# EasyEDA Pro project functional hub.epro, schematic Schematic1
Board Name: Board1; Create Date: 2026-05-01; Page Name: P1; Project Name: hub; Schematic Name: Schematic1; Update Date: 2026-05-04; Company: EasyEDA.com; Page Size: A4; Version: V1.0
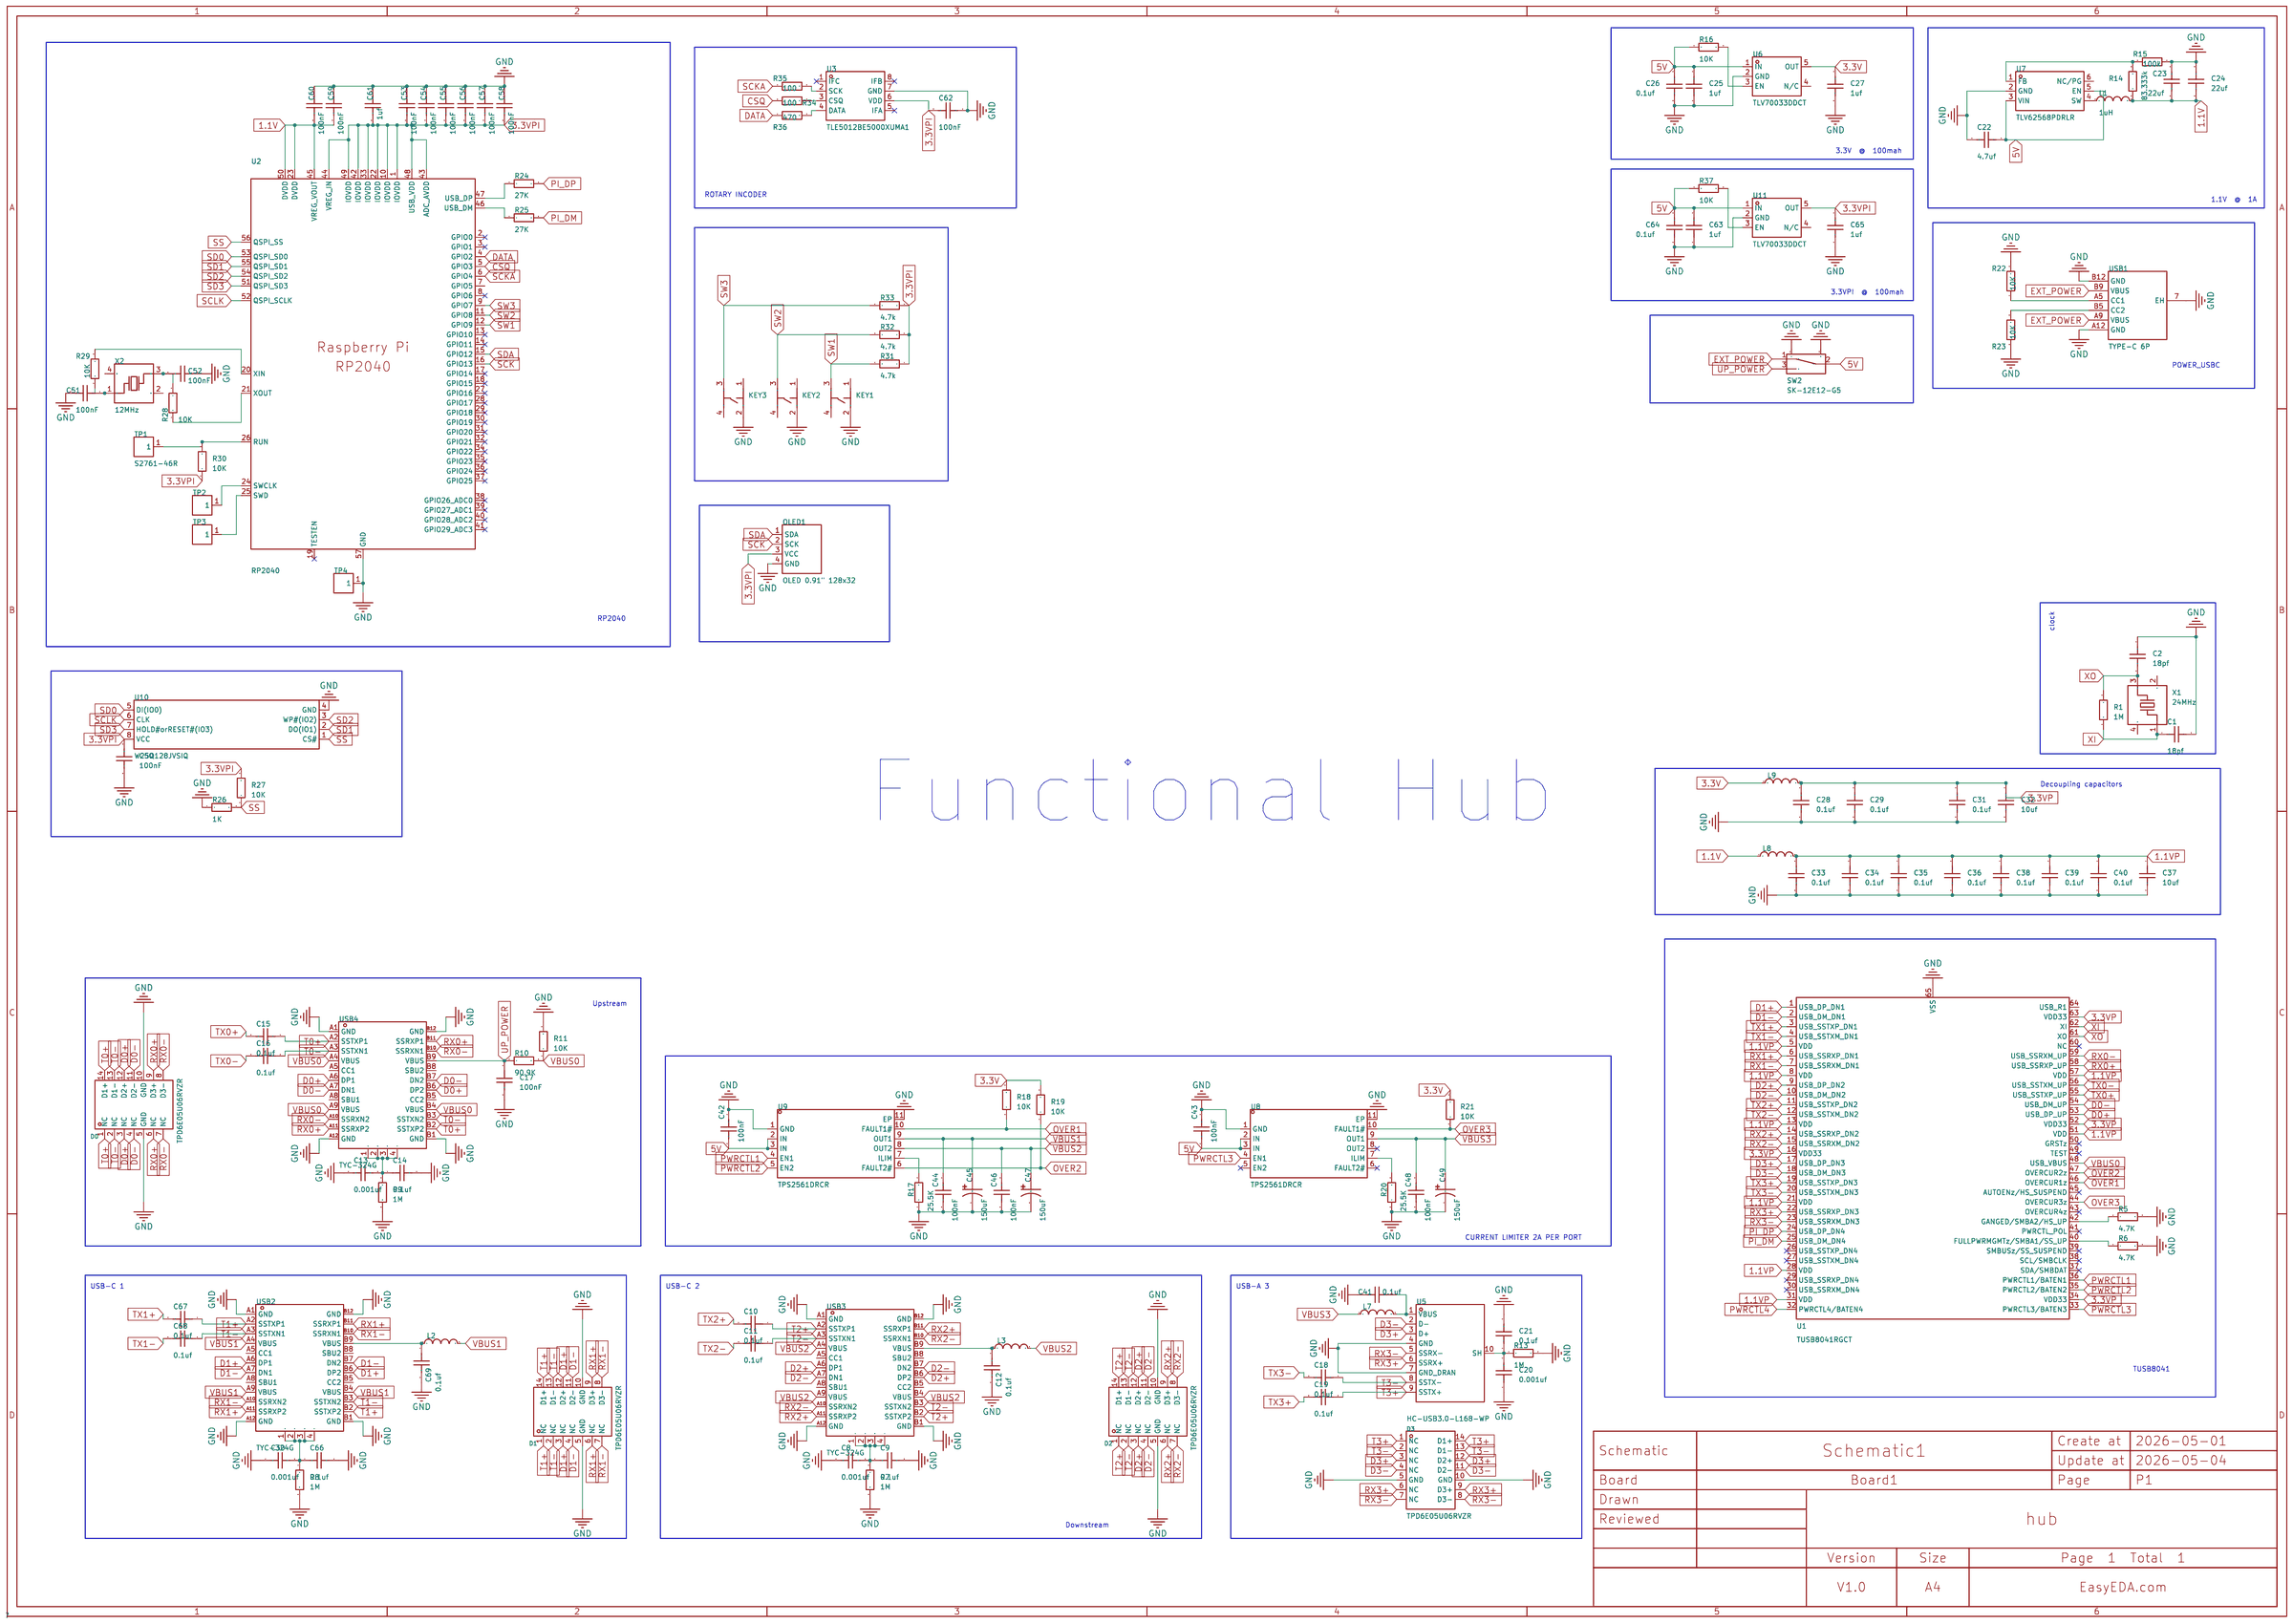
[diagram p0: schematic sheet]

## Parts
C1  18pf  [C0201]
C2  18pf  [C0201]
C8  0.001uf  [C0201]
C9  0.1uf  [C0201]
C10  0.1uf  [C0201]
C11  0.1uf  [C0201]
C12  0.1uf  [C0201]
C13  0.001uf  [C0201]
C14  0.1uf  [C0201]
C15  0.1uf  [C0201]
C16  0.1uf  [C0201]
C17  100nF  [C0201]
C18  0.1uf  [C0201]
C19  0.1uf  [C0201]
C20  0.001uf  [C0201]
C21  0.1uf  [C0201]
C22  4.7uf  [C0201]
C23  22uf  [C0201]
C24  22uf  [C0201]
C25  1uf  [C0201]
C26  0.1uf  [C0201]
C27  1uf  [C0201]
C28  0.1uf  [C0201]
C29  0.1uf  [C0201]
C30  0.001uf  [C0201]
C31  0.1uf  [C0201]
C32  10uf  [C0201]
C33  0.1uf  [C0201]
C34  0.1uf  [C0201]
C35  0.1uf  [C0201]
C36  0.1uf  [C0201]
C37  10uf  [C0201]
C38  0.1uf  [C0201]
C39  0.1uf  [C0201]
C40  0.1uf  [C0201]
C41  0.1uf  [C0201]
C42  100nF  [C0201]
C43  100nF  [C0201]
C44  100nF  [C0201]
C45  150uF  [CAP-SMD_BD5.0-L5.3-W5.3-FD]
C46  100nF  [C0201]
C47  150uF  [CAP-SMD_BD5.0-L5.3-W5.3-FD]
C48  100nF  [C0201]
C49  150uF  [CAP-SMD_BD5.0-L5.3-W5.3-FD]
C50  100nF  [C0201]
C51  100nF  [C0201]
C52  100nF  [C0201]
C53  100nF  [C0201]
C54  100nF  [C0201]
C55  100nF  [C0201]
C56  100nF  [C0201]
C57  100nF  [C0201]
C58  100nF  [C0201]
C59  100nF  [C0201]
C60  100nF  [C0201]
C61  1uf  [C0201]
C62  100nF  [C0201]
C63  1uf  [C0201]
C64  0.1uf  [C0201]
C65  1uf  [C0201]
C66  0.1uf  [C0201]
C67  0.1uf  [C0201]
C68  0.1uf  [C0201]
C69  0.1uf  [C0201]
D0  TPD6E05U06RVZR  [USON-14_L3.5-W1.4-P0.5-BL]
D1  TPD6E05U06RVZR  [USON-14_L3.5-W1.4-P0.5-BL]
D2  TPD6E05U06RVZR  [USON-14_L3.5-W1.4-P0.5-BL]
D3  TPD6E05U06RVZR  [USON-14_L3.5-W1.4-P0.5-BL]
KEY1  B3F-4055  [KEY-TH_4P-L12.0-W12.0-P5.00-LS13.4-EH]
KEY2  B3F-4055  [KEY-TH_4P-L12.0-W12.0-P5.00-LS13.4-EH]
KEY3  B3F-4055  [KEY-TH_4P-L12.0-W12.0-P5.00-LS13.4-EH]
L1  1uH  [L0402]
L2  BLM18KG221SN1D  [L0402]
L3  BLM18KG221SN1D  [L0402]
L7  BLM18KG221SN1D  [L0402]
L8  BLM18KG221SN1D  [L0402]
L9  BLM18KG221SN1D  [L0402]
OLED1  OLED 0.91" 128x32  [OLED_0.91_128X32]
R1  1M  [R0201]
R5  4.7K  [R0201]
R6  4.7K  [R0201]
R7  1M  [R0201]
R8  1M  [R0201]
R9  1M  [R0201]
R10  90.9K  [R0201]
R11  10K  [R0201]
R13  1M  [R0201]
R14  83.333k  [R0201]
R15  100k  [R0201]
R16  10K  [R0201]
R17  25.5K  [R0201]
R18  10K  [R0201]
R19  10K  [R0201]
R20  25.5K  [R0201]
R21  10K  [R0201]
R22  10K  [R0201]
R23  10K  [R0201]
R24  27K  [R0201]
R25  27K  [R0201]
R26  1K  [R0201]
R27  10K  [R0201]
R28  10K  [R0201]
R29  10K  [R0201]
R30  10K  [R0201]
R31  4.7k  [R0201]
R32  4.7k  [R0201]
R33  4.7k  [R0201]
R34  100  [R0201]
R35  100  [R0201]
R36  470  [R0201]
R37  10K  [R0201]
SW2  SK-12E12-G5  [SW-TH_SK-12E12-G5]
TP1  S2761-46R  [TESTPOINT-SMD_L1.6-W0.8_RCU-0C]
TP2  S2761-46R  [TESTPOINT-SMD_L1.6-W0.8_RCU-0C]
TP3  S2761-46R  [TESTPOINT-SMD_L1.6-W0.8_RCU-0C]
TP4  S2761-46R  [TESTPOINT-SMD_L1.6-W0.8_RCU-0C]
U1  TUSB8041RGCT  [VQFN-64_L9.0-W9.0-P0.50-TL-EP6.3]
U2  RP2040  [LQFN-56_L7.0-W7.0-P0.4-EP]
U3  TLE5012BE5000XUMA1  [PG-DSO-8_L5.0-W4.0-P1.27-LS6.0-BL]
U5  HC-USB3.0-L168-WP  [USB-TH_USB3.0-A]
U6  TLV70033DDCT  [SOT-23-5_L2.9-W1.6-P0.95-LS2.8-BR]
U7  TLV62568PDRLR  [SOT-563_L1.6-W1.2-P0.50-LS1.6-BL]
U8  TPS2561DRCR  [VSON-10_L3.0-W3.0-P0.50-TL-EP_TPS62410DRCR]
U9  TPS2561DRCR  [VSON-10_L3.0-W3.0-P0.50-TL-EP_TPS62410DRCR]
U10  W25Q128JVSIQ  [SOIC-8_L5.3-W5.3-P1.27-LS8.0-BL]
U11  TLV70033DDCT  [SOT-23-5_L2.9-W1.6-P0.95-LS2.8-BR]
USB1  TYPE-C 6P  [TYPE-C-SMD_TYPE-C-6P_1]
USB2  TYC-324G  [USB-C-SMD_TYC-324G]
USB3  TYC-324G  [USB-C-SMD_TYC-324G]
USB4  TYC-324G  [USB-C-SMD_TYC-324G]
X1  24MHz  [CRYSTAL-SMD_4P-L3.2-W2.5-BL]
X2  12MHz  [CRYSTAL-SMD_4P-L3.2-W2.5-BL]

## Library data of the parts
C1 C2 C8-C44 C46 C48 C50-C69 = CAP_0603: Supplier Footprint: 0603
C45 C47 C49 = VZT151M1VTR-0607: Capacitance:150uF Tolerance:±20% Tolerance:±20% Voltage Rating:35V Ripple Current:- Equivalent Series Resistance(ESR):- Diameter:6.3mm Height - Seated (Max):7.7mm Lifetime:2000hrs@105℃ Operating Temperature:-45℃~+105℃ Operating Temperature:-45℃~+105℃; LCSC Part Name: 150uF ±20% 35V; Supplier Part: C249984; Manufacturer: Lelon(立隆); Supplier Footprint: SMD,D6.3xL7.7mm; JLCPCB Part Class: Extended Part; Datasheet: https://item.szlcsc.com/datasheet/VZT151M1VTR-0607/246106.html; Supplier: LCSC; Tolerance: ±20%; Voltage Rating: 35V; Diameter: 6.3mm; Height - Seated (Max): 7.7mm; Lifetime: 2000hrs@105℃; Operating Temperature: -45℃~+105℃
D0-D3 = TPD6E05U06RVZR: Reverse Stand-Off Voltage (Vrwm):5.5V@Max Maximum Clamping Voltage:14V Peak Pulse Current (Ipp)@10/1000us:- Peak Pulse Power Dissipation (Ppp)@10/1000us:40W Breakdown Voltage:6V Type:TVS; Supplier Part: C962978; Manufacturer: TI(德州仪器); Supplier Footprint: USON-14(1.4x3.5); JLCPCB Part Class: Extended Part; Datasheet: https://www.ti.com/cn/lit/gpn/tpd1e05u06; Supplier: LCSC; Reverse Stand-Off Voltage (Vrwm): 5.5V@Max; Maximum Clamping Voltage: 14V; Peak Pulse Power Dissipation (Ppp)@10/1000us: 40W; Breakdown Voltage: 6V; Type: TVS
KEY1-KEY3 = B3F-4055_C84931: Circuit:SPST Actuator Style:Rectangular Button Mounting Type:Through Hole Length:12mm Width:12mm Switch Height:7.3mm Contact Current:50mA Voltage Rating:24V With Lamp:- Life:-; LCSC Part Name: 12*12*7.3mm 直插 轻触开关; Supplier Part: C84931; Manufacturer: OMRON(欧姆龙); Supplier Footprint: 插件-4P,12x12mm; JLCPCB Part Class: Extended Part; Datasheet: https://item.szlcsc.com/datasheet/B3F-4055/86103.html; Supplier: LCSC; Circuit: SPST; Actuator Style: Rectangular Button; Mounting Type: Through Hole; Length: 12mm; Width: 12mm; Switch Height: 7.3mm; Contact Current: 50mA; Voltage Rating: 24V
L1 = L_0603: Supplier Footprint: L0603
L2 L3 L7-L9 = BLM18KG221SN1D: Impedance @ Frequency:220Ω@100MHz Tolerance:±25% Tolerance:±25% DC Resistance(DCR):50mΩ Current Rating:2.2A Number of Circuits:1 Operating Temperature:-55℃~+125℃ Operating Temperature:-55℃~+125℃; LCSC Part Name: 单路 0603磁珠 阻抗220Ω@100MHz; Supplier Part: C88980; Manufacturer: muRata(村田); Supplier Footprint: 0603; JLCPCB Part Class: Extended Part; Datasheet: https://item.szlcsc.com/datasheet/BLM18KG221SN1D/90160.html; Supplier: LCSC; Impedance @ Frequency: 220Ω@100MHz; Tolerance: ±25%; DC Resistance(DCR): 50mΩ; Current Rating: 2.2A; Number of Circuits: 1; Operating Temperature: -55℃~+125℃
OLED1 = OLED 0.91" 128x32: Supplier: LCSC; Supplier Part: C91220
R1 R5-R11 R13-R37 = Res_0603: Supplier Footprint: 0603
SW2 = SK-12E12-G5: Circuit:SPDT Actuator Style:Rectangular Columnar Termination Style:PC Pin Switch Height:10.6mm Mounting Type:- Current Rating:- Voltage Rating:- Life:5,000 Cycles Operating Temperature:-25℃~+70℃ Operating Temperature:-25℃~+70℃; LCSC Part Name: 卧插双档 滑动开关; Supplier Part: C136720; Manufacturer: 韩国韩荣; Supplier Footprint: 插件; JLCPCB Part Class: Extended Part; Datasheet: https://item.szlcsc.com/datasheet/SK-12E12-G5/148036.html; Supplier: LCSC; Circuit: SPDT; Actuator Style: Rectangular Columnar; Termination Style: PC Pin; Switch Height: 10.6mm; Life: 5,000 Cycles; Operating Temperature: -25℃~+70℃
TP1-TP4 = S2761-46R: LCSC Part Name: SMT测试端子; Supplier Part: C5846954; Manufacturer: Harwin; JLCPCB Part Class: Extended Part; Datasheet: https://item.szlcsc.com/datasheet/S2761-46R/6779008.html; Supplier: LCSC
U1 = TUSB8041RGCT: type:Hub USB Protocol:USB 3.0；USB 2.0 Voltage - Supply:0.99V~1.26V；3V~3.6V Voltage - Supply:0.99V~1.26V；3V~3.6V Operating Temperature:0℃~+70℃ Operating Temperature:0℃~+70℃ Memory Interface:I2C；SMBus Current - Supply:778mA Quiescent Supply Current:33mA Num; LCSC Part Name: 四端口USB3.0集线器; Supplier Part: C702388; Manufacturer: TI(德州仪器); Supplier Footprint: VQFN-64-EP(9x9); Datasheet: https://www.ti.com/cn/lit/gpn/tusb8041; Supplier: LCSC; type: Hub; USB Protocol: USB 3.0；USB 2.0; Voltage - Supply: 0.99V~1.26V；3V~3.6V; Operating Temperature: 0℃~+70℃; Memory Interface: I2C；SMBus; Current - Supply: 778mA; Quiescent Supply Current: 33mA; Number of Channels: 4
U2 = RP2040_C2040: CPU Core:- CPU Maximum Speed:133MHz Number of I/O:30 ADC (Bit):12bit; LCSC Part Name: RP2040（RP2B2）; Supplier Part: C2040; Manufacturer: Raspberry Pi(树莓派); Supplier Footprint: LQFN-56(7x7); JLCPCB Part Class: Extended Part; Datasheet: https://item.szlcsc.com/datasheet/RP2040/2392.html; Supplier: LCSC; CPU Maximum Speed: 133MHz; Number of I/O: 30; ADC (Bit): 12bit
U3 = TLE5012BE5000XUMA1: Voltage - Supply:3V~5.5V Voltage - Supply:3V~5.5V Rotation Angle:0°~360° Rotation Angle:0°~360°; Supplier Part: C2655225; Manufacturer: Infineon(英飞凌); Supplier Footprint: SO-8; Datasheet: https://item.szlcsc.com/datasheet/TLE5012BE5000XUMA1/2747134.html; Supplier: LCSC; Voltage - Supply: 3V~5.5V; Rotation Angle: 0°~360°
U5 = HC-USB3.0-L168-WP: Connector Type:Type-A Protocol Standard:USB 3.0 Gender:Female Mounting Type:Right Angle Number of Contacts:9P Number of Ports:1 Current Rating-Power:1.5A Voltage Rating:30V Connect-Disconnect Life:1,500 Cycles Supplementary Features:- Center Height:- Leng; LCSC Part Name: Type-A 母 弯插 USB3.0 A母90度 弯脚蓝色平口 吸塑盒; Supplier Part: C7501850; Manufacturer: HC(虹成电子); Supplier Footprint: 弯插; Datasheet: https://item.szlcsc.com/datasheet/HC-USB3.0-L168-WP/8585391.html; Supplier: LCSC; Connector Type: Type-A; Protocol Standard: USB 3.0; Gender: Female; Mounting Type: Right Angle; Number of Contacts: 9P; Number of Ports: 1; Current Rating-Power: 1.5A; Voltage Rating: 30V; Connect-Disconnect Life: 1,500 Cycles; Length: 16.8mm; Detection color: Blue; Operating Temperature: -25℃~+70℃
U6 U11 = TLV70033DDCT: Output Type:Fixed Voltage - Supply:5.5V Output Voltage:3.3V Output Voltage:3.3V Output Current:200mA Power Supply Rejection Ratio (PSRR):68dB@(1kHz) Voltage Dropout:175mV@(200mA) standby current:31uA Noise:48uVrms Features:Enable；Over Temperature Protecti; LCSC Part Name: 具有使能功能的 200mA、高 PSRR、低 IQ、低压降稳压器; Supplier Part: C2877582; Manufacturer: TI(德州仪器); Supplier Footprint: SOT-23-5; JLCPCB Part Class: Extended Part; Datasheet: https://www.ti.com/cn/lit/gpn/tlv700; Supplier: LCSC; Output Type: Fixed; Voltage - Supply: 5.5V; Output Voltage: 3.3V; Output Current: 200mA; Power Supply Rejection Ratio (PSRR): 68dB@(1kHz); Voltage Dropout: 175mV@(200mA); standby current: 31uA; Noise: 48uVrms; Features: Enable；Over Temperature Protection；Over Current Protection; Operating Temperature: -40℃~+125℃@(Tj); Output Configuration: Positive; Number of Outputs: 1
U7 = TLV62568PDRLR: Function:Buck Voltage - Supply:2.5V~5.5V Voltage - Supply:2.5V~5.5V Output Voltage:600mV~5.5V Output Voltage:600mV~5.5V Output Current:1A Frequency - Switching:1.5MHz Frequency - Switching:1.5MHz Operating Temperature:-40℃~+125℃@(TJ) Operating Temperature; Supplier Part: C398368; Manufacturer: TI(德州仪器); Supplier Footprint: SOT-563; JLCPCB Part Class: Extended Part; Datasheet: https://www.ti.com/cn/lit/gpn/tlv62568; Supplier: LCSC; Function: Buck; Voltage - Supply: 2.5V~5.5V; Output Voltage: 600mV~5.5V; Output Current: 1A; Frequency - Switching: 1.5MHz; Operating Temperature: -40℃~+125℃@(TJ); Synchronous Rectifier: Yes; Number of Outputs: 1; Topology: Buck; Quiescent Current: 35uA; Switch tube (built-in/external): Built-In; Output Type: Adjustable
U8 U9 = TPS2561DRCR: Type:High Side Switch Number of Channels:2 Control Input Logic:Active High Maximum Continuous Current:2.8A Voltage - Supply:2.5V~6.5V Voltage - Supply:2.5V~6.5V RDS(on):44mΩ Operating Temperature-:-40℃~+125℃ Operating Temperature-:-40℃~+125℃ Features:Ov; LCSC Part Name: 双通道精密可调限流电源开关; Supplier Part: C140303; Manufacturer: TI(德州仪器); Supplier Footprint: VSON-10-EP(3x3); JLCPCB Part Class: Extended Part; Datasheet: https://www.ti.com/cn/lit/gpn/tps2561; Supplier: LCSC; Type: High Side Switch; Number of Channels: 2; Control Input Logic: Active High; Maximum Continuous Current: 2.8A; Voltage - Supply: 2.5V~6.5V; RDS(on): 44mΩ; Operating Temperature	-: -40℃~+125℃; Features: Overtemperature protection (OTP)；Overcurrent Protection(OCP)
U10 = W25Q128JVSIQ_C113767: Interface:SPI Memory Size:- Clock Frequency:133MHz Voltage - Supply:2.7V~3.6V Voltage - Supply:2.7V~3.6V Program / Erase Cycles:100,000 Cycles Page Programming Time (Tpp):3ms Operating Temperature:- Operating Temperature:-; LCSC Part Name: 支持双路/四路SPI接口的3V、128Mbit 串行闪存; Supplier Part: C113767; Manufacturer: Winbond(华邦); Supplier Footprint: SOIC-8-208mil; JLCPCB Part Class: Extended Part; Datasheet: https://item.szlcsc.com/datasheet/W25Q128JVSIQ/115003.html; Supplier: LCSC; Interface: SPI; Clock Frequency: 133MHz; Voltage - Supply: 2.7V~3.6V; Program / Erase Cycles: 100,000 Cycles; Page Programming Time (Tpp): 3ms
USB1 = TYPE-C 6P: Connector Type:Type-C Protocol Standard:- Gender:Female Mounting Type:Surface Mount, Right Angle Number of Contacts:6P Number of Ports:1 Current Rating-Power:3A Voltage Rating:5V Connect-Disconnect Life:3,000 Cycles Supplementary Features:- Center Height:; LCSC Part Name: 6P卧贴母座; Supplier Part: C456012; Manufacturer: SHOU HAN(首韩); Supplier Footprint: SMD; JLCPCB Part Class: Extended Part; Datasheet: https://item.szlcsc.com/datasheet/TYPE-C%25206P/458819.html; Supplier: LCSC; Connector Type: Type-C; Gender: Female; Mounting Type: Surface Mount, Right Angle; Number of Contacts: 6P; Number of Ports: 1; Current Rating-Power: 3A; Voltage Rating: 5V; Connect-Disconnect Life: 3,000 Cycles; Detection color: Black; Operating Temperature: -40℃~+85℃
USB2-USB4 = TYC-324G: Connector Type:Type-C Protocol Standard:USB 3.1 Gender:Female Mounting Type:Surface Mount, Right Angle Number of Contacts:24P Number of Ports:1 Current Rating-Power:5A Voltage Rating:- Connect-Disconnect Life:10,000 Cycles Length:7.9mm Detection color:Bla; LCSC Part Name: Type-C 母 卧贴; Supplier Part: C381478; Manufacturer: XUNPU(讯普); Supplier Footprint: SMD; JLCPCB Part Class: Extended Part; Datasheet: https://item.szlcsc.com/datasheet/TYC-324G/354099.html; Supplier: LCSC; Connector Type: Type-C; Protocol Standard: USB 3.1; Gender: Female; Mounting Type: Surface Mount, Right Angle; Number of Contacts: 24P; Number of Ports: 1; Current Rating-Power: 5A; Connect-Disconnect Life: 10,000 Cycles; Length: 7.9mm; Detection color: Black; Operating Temperature: -30℃~+80℃
X1 = ABM8-24.000MHZ-B2-T: Type:Crystal Oscillator Frequency:24MHz Normal temperature Frequency Tolerance:±20ppm Normal temperature Frequency Tolerance:±20ppm Load Capacitance:18pF Frequency Stability:±50ppm Frequency Stability:±50ppm Equivalent Series Resistance(ESR):50Ω Operating; LCSC Part Name: 24MHz ±20ppm 18pF; Supplier Part: C596897; Manufacturer: ABRACON; Supplier Footprint: SMD3225-4P; Datasheet: https://item.szlcsc.com/datasheet/ABM8-24.000MHZ-B2-T/625513.html; Supplier: LCSC; Type: Crystal Oscillator; Normal temperature Frequency Tolerance: ±20ppm; Load Capacitance: 18pF; Frequency Stability: ±50ppm; Equivalent Series Resistance(ESR): 50Ω; Operating Temperature: -20℃~+70℃
X2 = X322512MSB4SI: Type:Crystal Oscillator Frequency:12MHz Normal temperature Frequency Tolerance:±10ppm Normal temperature Frequency Tolerance:±10ppm Load Capacitance:20pF Frequency Stability:±20ppm Frequency Stability:±20ppm Operating Temperature:-40℃~+85℃ Operating Tempe; LCSC Part Name: YSX321SL 12MHZ 4P 3225 20PF ±10PPM -40~85℃ (±20PPM); Supplier Part: C9002; Manufacturer: YXC(扬兴晶振); Supplier Footprint: SMD3225-4P; JLCPCB Part Class: Basic Part; Datasheet: https://item.szlcsc.com/datasheet/X322512MSB4SI/9522.html; Supplier: LCSC; Type: Crystal Oscillator; Normal temperature Frequency Tolerance: ±10ppm; Load Capacitance: 20pF; Frequency Stability: ±20ppm; Operating Temperature: -40℃~+85℃

## Nets
1.1V: C23.2 C24.1 C59.2 C60.2 L1.2 L8.1 R14.1 U2.23(DVDD) U2.45(VREG_VOUT) U2.50(DVDD)
1.1VP: C33.1 C34.1 C35.1 C36.1 C37.1 C38.1 C39.1 C40.1 L8.2 U1.5(VDD) U1.8(VDD) U1.13(VDD) U1.21(VDD) U1.28(VDD) U1.31(VDD) U1.51(VDD) U1.57(VDD)
3.3V: C27.1 L9.1 R18.2 R19.2 R21.2 U6.5(OUT)
3.3VP: C28.1 C29.1 C31.1 C32.1 L9.2 U1.16(VDD33) U1.34(VDD33) U1.52(VDD33) U1.63(VDD33)
3.3VPI: C50.1 C53.2 C54.2 C55.2 C56.2 C57.2 C58.2 C61.2 C62.2 C65.1 OLED1.3(VCC) R27.2 R30.1 R31.1 R32.1 R33.1 U2.1(IOVDD) U2.10(IOVDD) U2.22(IOVDD) U2.33(IOVDD) U2.42(IOVDD) U2.43(ADC_AVDD) U2.44(VREG_IN) U2.48(USB_VDD) U2.49(IOVDD) U3.6(VDD) U10.8(VCC) U11.5(OUT)
5V: C22.2 C25.1 C26.1 C42.2 C43.2 C63.1 C64.1 R16.1 R37.1 SW2.2 U6.1(IN) U7.3(VIN) U7.5(EN) U8.2(IN) U8.3(IN) U9.2(IN) U9.3(IN) U11.1(IN)
GND: C1.2 C2.1 C8.1 C9.2 C12.2 C13.1 C14.2 C17.2 C20.1 C21.2 C22.1 C23.1 C24.2 C25.2 C26.2 C27.2 C28.2 C29.2 C30.1 C31.2 C32.2 C33.2 C34.2 C35.2 C36.2 C37.2 C38.2 C39.2 C40.2 C41.1 C42.1 C43.1 C44.2 C45.2 C46.2 C47.2 C48.2 C49.2 C50.2 C51.2 C52.1 C53.1 C54.1 C55.1 C56.1 C57.1 C58.1 C59.1 C60.1 C61.1 C62.1 C63.2 C64.2 C65.2 C66.2 C69.2 D0.5(GND) D0.10(GND) D1.5(GND) D1.10(GND) D2.5(GND) D2.10(GND) D3.5(GND) D3.10(GND) KEY1.2 KEY2.2 KEY3.2 OLED1.4(GND) R5.2 R6.2 R7.2 R8.2 R9.2 R11.2 R13.2 R15.1 R17.1 R20.1 R22.2 R23.1 R26.1 SW2.4 SW2.5 TP4.1 U1.65(VSS) U2.57(GND) U3.7(GND) U5.4(GND) U5.7(GND_DRAN) U6.2(GND) U7.2(GND) U8.1(GND) U8.11(EP) U9.1(GND) U9.11(EP) U10.4(GND) U11.2(GND) USB1.7(EH) USB1.A12(GND) USB1.B12(GND) USB2.A1(GND) USB2.A12(GND) USB2.B1(GND) USB2.B12(GND) USB3.A1(GND) USB3.A12(GND) USB3.B1(GND) USB3.B12(GND) USB4.A1(GND) USB4.A12(GND) USB4.B1(GND) USB4.B12(GND)
VBUS0: R10.2 R11.1 U1.48(USB_VBUS) USB4.A4(VBUS) USB4.A9(VBUS) USB4.B4(VBUS)
VBUS1: C44.1 C45.1 L2.2 U9.9(OUT1) USB2.A4(VBUS) USB2.A9(VBUS) USB2.B4(VBUS)
VBUS2: C46.1 C47.1 L3.2 U9.8(OUT2) USB3.A4(VBUS) USB3.A9(VBUS) USB3.B4(VBUS)
VBUS3: C48.1 C49.1 L7.1 U8.9(OUT1)
CSQ: R34.1 U2.5(GPIO3)
D0+: D0.3(NC) D0.12(D2+) U1.53(USB_DP_UP) USB4.A6(DP1) USB4.B6(DP2)
D0-: D0.4(NC) D0.11(D2-) U1.54(USB_DM_UP) USB4.A7(DN1) USB4.B7(DN2)
D1+: D1.3(NC) D1.12(D2+) U1.1(USB_DP_DN1) USB2.A6(DP1) USB2.B6(DP2)
D1-: D1.4(NC) D1.11(D2-) U1.2(USB_DM_DN1) USB2.A7(DN1) USB2.B7(DN2)
D2+: D2.3(NC) D2.12(D2+) U1.9(USB_DP_DN2) USB3.A6(DP1) USB3.B6(DP2)
D2-: D2.4(NC) D2.11(D2-) U1.10(USB_DM_DN2) USB3.A7(DN1) USB3.B7(DN2)
D3+: D3.3(NC) D3.12(D2+) U1.17(USB_DP_DN3) U5.3(D+)
D3-: D3.4(NC) D3.11(D2-) U1.18(USB_DM_DN3) U5.2(D-)
DATA: R36.1 U2.4(GPIO2)
EXT_POWER: SW2.1 USB1.A9(VBUS) USB1.B9(VBUS)
OVER1: R18.1 U1.46(OVERCUR1z) U9.10(FAULT1#)
OVER2: R19.1 U1.47(OVERCUR2z) U9.6(FAULT2#)
OVER3: R21.1 U1.44(OVERCUR3z) U8.10(FAULT1#)
PI_DM: R25.2 U1.25(USB_DM_DN4)
PI_DP: R24.2 U1.24(USB_DP_DN4)
PWRCTL1: U1.36(PWRCTL1/BATEN1) U9.4(EN1)
PWRCTL2: U1.35(PWRCTL2/BATEN2) U9.5(EN2)
PWRCTL3: U1.33(PWRCTL3/BATEN3) U8.4(EN1)
PWRCTL4: U1.32(PWRCTL4/BATEN4)
RX0+: D0.6(NC) D0.9(D3+) U1.58(USB_SSRXP_UP) USB4.A11(SSRXP2) USB4.B11(SSRXP1)
RX0-: D0.7(NC) D0.8(D3-) U1.59(USB_SSRXM_UP) USB4.A10(SSRXN2) USB4.B10(SSRXN1)
RX1+: D1.6(NC) D1.9(D3+) U1.6(USB_SSRXP_DN1) USB2.A11(SSRXP2) USB2.B11(SSRXP1)
RX1-: D1.7(NC) D1.8(D3-) U1.7(USB_SSRXM_DN1) USB2.A10(SSRXN2) USB2.B10(SSRXN1)
RX2+: D2.6(NC) D2.9(D3+) U1.14(USB_SSRXP_DN2) USB3.A11(SSRXP2) USB3.B11(SSRXP1)
RX2-: D2.7(NC) D2.8(D3-) U1.15(USB_SSRXM_DN2) USB3.A10(SSRXN2) USB3.B10(SSRXN1)
RX3+: D3.6(NC) D3.9(D3+) U1.22(USB_SSRXP_DN3) U5.6(SSRX+)
RX3-: D3.7(NC) D3.8(D3-) U1.23(USB_SSRXM_DN3) U5.5(SSRX-)
SCK: OLED1.2(SCK) U2.16(GPIO13)
SCKA: R35.1 U2.6(GPIO4)
SCLK: U2.52(QSPI_SCLK) U10.6(CLK)
SD0: U2.53(QSPI_SD0) U10.5(DI(IO0))
SD1: U2.55(QSPI_SD1) U10.2(DO(IO1))
SD2: U2.54(QSPI_SD2) U10.3(WP#(IO2))
SD3: U2.51(QSPI_SD3) U10.7(HOLD#orRESET#(IO3))
SDA: OLED1.1(SDA) U2.15(GPIO12)
SS: R26.2 R27.1 U2.56(QSPI_SS) U10.1(CS#)
SW1: KEY1.3 R31.2 U2.12(GPIO9)
SW2: KEY2.3 R32.2 U2.11(GPIO8)
SW3: KEY3.3 R33.2 U2.9(GPIO7)
T0+: C15.1 D0.1(NC) D0.14(D1+) USB4.A2(SSTXP1) USB4.B2(SSTXP2)
T0-: C16.1 D0.2(NC) D0.13(D1-) USB4.A3(SSTXN1) USB4.B3(SSTXN2)
T1+: C67.1 D1.1(NC) D1.14(D1+) USB2.A2(SSTXP1) USB2.B2(SSTXP2)
T1-: C68.1 D1.2(NC) D1.13(D1-) USB2.A3(SSTXN1) USB2.B3(SSTXN2)
T2+: C10.1 D2.1(NC) D2.14(D1+) USB3.A2(SSTXP1) USB3.B2(SSTXP2)
T2-: C11.1 D2.2(NC) D2.13(D1-) USB3.A3(SSTXN1) USB3.B3(SSTXN2)
T3+: C19.1 D3.1(NC) D3.14(D1+) U5.9(SSTX+)
T3-: C18.1 D3.2(NC) D3.13(D1-) U5.8(SSTX-)
TX0+: C15.2 U1.55(USB_SSTXP_UP)
TX0-: C16.2 U1.56(USB_SSTXM_UP)
TX1+: C67.2 U1.3(USB_SSTXP_DN1)
TX1-: C68.2 U1.4(USB_SSTXM_DN1)
TX2+: C10.2 U1.11(USB_SSTXP_DN2)
TX2-: C11.2 U1.12(USB_SSTXM_DN2)
TX3+: C19.2 U1.19(USB_SSTXP_DN3)
TX3-: C18.2 U1.20(USB_SSTXM_DN3)
UP_POWER: C17.1 R10.1 SW2.3 USB4.B9(VBUS)
XI: C1.1 R1.1 U1.62(XI) X1.1
XO: C2.2 R1.2 U1.61(XO) X1.3
$1N3195: R5.1 U1.42(GANGED/SMBA2/HS_UP)
$1N3221: R6.1 U1.40(FULLPWRMGMTz/SMBA1/SS_UP)
$1N7398: L1.1 U7.4(SW)
$1N7474: R14.2 R15.2 U7.1(FB)
$1N11667: R17.2 U9.7(ILIM)
$1N12274: R20.2 U8.7(ILIM)
$1N13220: R24.1 U2.47(USB_DP)
$1N13246: R25.1 U2.46(USB_DM)
$1N13961: C51.1 R29.1 X2.1(OSC1)
$1N13963: C52.2 R28.2 X2.3(OSC2)
$1N14103: R28.1 U2.21(XOUT)
$1N14108: R29.2 U2.20(XIN)
$1N15444: R34.2 U3.3(CSQ)
$1N15470: R35.2 U3.2(SCK)
$1N15496: R36.2 U3.4(DATA)
$1N22955: R16.2 U6.3(EN)
$1N22971: R37.2 U11.3(EN)
Net-(C8-2): C8.2 C9.1 R7.1 USB3.1 USB3.2 USB3.3 USB3.4
Net-(C12-1): C12.1 L3.1 USB3.B9(VBUS)
Net-(C13-2): C13.2 C14.1 R9.1 USB4.1 USB4.2 USB4.3 USB4.4
Net-(C20-2): C20.2 C21.1 R13.1 U5.10(SH)
Net-(C30-2): C30.2 C66.1 R8.1 USB2.1 USB2.2 USB2.3 USB2.4
Net-(C41-2): C41.2 L7.2 U5.1(VBUS)
Net-(C69-1): C69.1 L2.1 USB2.B9(VBUS)
Net-(R22-1): R22.1 USB1.A5(CC1)
Net-(R23-2): R23.2 USB1.B5(CC2)
Net-(R30-2): R30.2 TP1.1 U2.26(RUN)
Net-(TP2-1): TP2.1 U2.24(SWCLK)
Net-(TP3-1): TP3.1 U2.25(SWD)

Not connected (* = marked no-connect by the designer): KEY1 1 4; KEY2 1 4; KEY3 1 4; U1 26(USB_SSTXP_DN4)* 27(USB_SSTXM_DN4)* 29(USB_SSRXP_DN4)* 30(USB_SSRXM_DN4)* 37(SDA/SMBDAT)* 38(SCL/SMBCLK)* 39(SMBUSz/SS_SUSPEND)* 41(PWRCTL_POL)* 43(OVERCUR4z)* 45(AUTOENz/HS_SUSPEND)* 49(TEST)* 50(GRSTz)* 60(NC)* 64(USB_R1); U2 2(GPIO0)* 3(GPIO1)* 7(GPIO5) 8(GPIO6)* 13(GPIO10)* 14(GPIO11)* 17(GPIO14)* 18(GPIO15)* 19(TESTEN)* 27(GPIO16)* 28(GPIO17)* 29(GPIO18)* 30(GPIO19)* 31(GPIO20)* 32(GPIO21)* 34(GPIO22)* 35(GPIO23)* 36(GPIO24)* 37(GPIO25)* 38(GPIO26_ADC0)* 39(GPIO27_ADC1)* 40(GPIO28_ADC2)* 41(GPIO29_ADC3)*; U3 1(IFC)* 5(IFA)* 8(IFB)*; U6 4(N/C); U7 6(NC/PG); U8 5(EN2)* 6(FAULT2#)* 8(OUT2)*; U11 4(N/C); USB2 A5(CC1) A8(SBU1) B5(CC2) B8(SBU2); USB3 A5(CC1) A8(SBU1) B5(CC2) B8(SBU2); USB4 A5(CC1) A8(SBU1) B5(CC2) B8(SBU2); X1 2(GND) 4(GND); X2 2(GND) 4(GND)

## Notes on the sheet
- 3.3V  @  100mah
- ROTARY INCODER
- 1.1V  @  1A
- 3.3VPI  @  100mah
- POWER_USBC
- RP2040
- clock
- Decoupling capacitors
- Functional Hub
- Upstream
- CURRENT LIMITER 2A PER PORT
- USB-C 1
- USB-C 2
- USB-A 3
- TUSB8041
- Downstream
